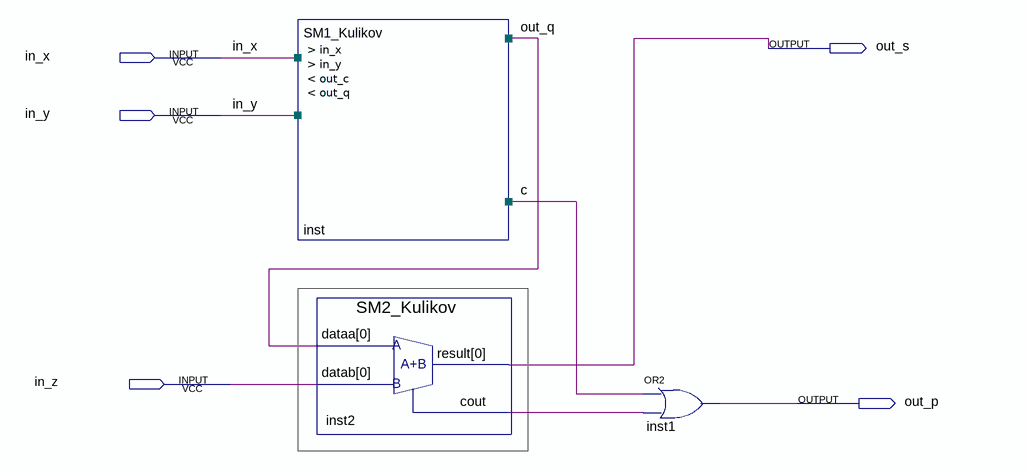
[diagram p0: schematic sheet]
// Quartus schematic CLProject_Kulikov_IO42_v1.bdf as structural Verilog: 3 symbols, 5 pins
module CLProject_Kulikov_IO42_v1 (
  input  in_x,
  input  in_y,
  input  in_z,
  output out_s,
  output out_p
);

  wire c, inst2_cout, out_q;

  SM1_Kulikov inst (.in_x(in_x), .in_y(in_y), .out_c(c), .out_q(out_q));
  SM2_Kulikov inst2 (.dataa(out_q), .datab(in_z), .result(out_s), .cout(inst2_cout));
  or inst1 (out_p, c, inst2_cout);
endmodule
